# EasyEDA schematic oLoRa-part-SD.json
TITLE: oLoRa-part-SD; REV: 1.0; Date: 2019-08-25; Sheet: 1/1; Drawn By: Kim Seok Hyeon; Company: RMTEC
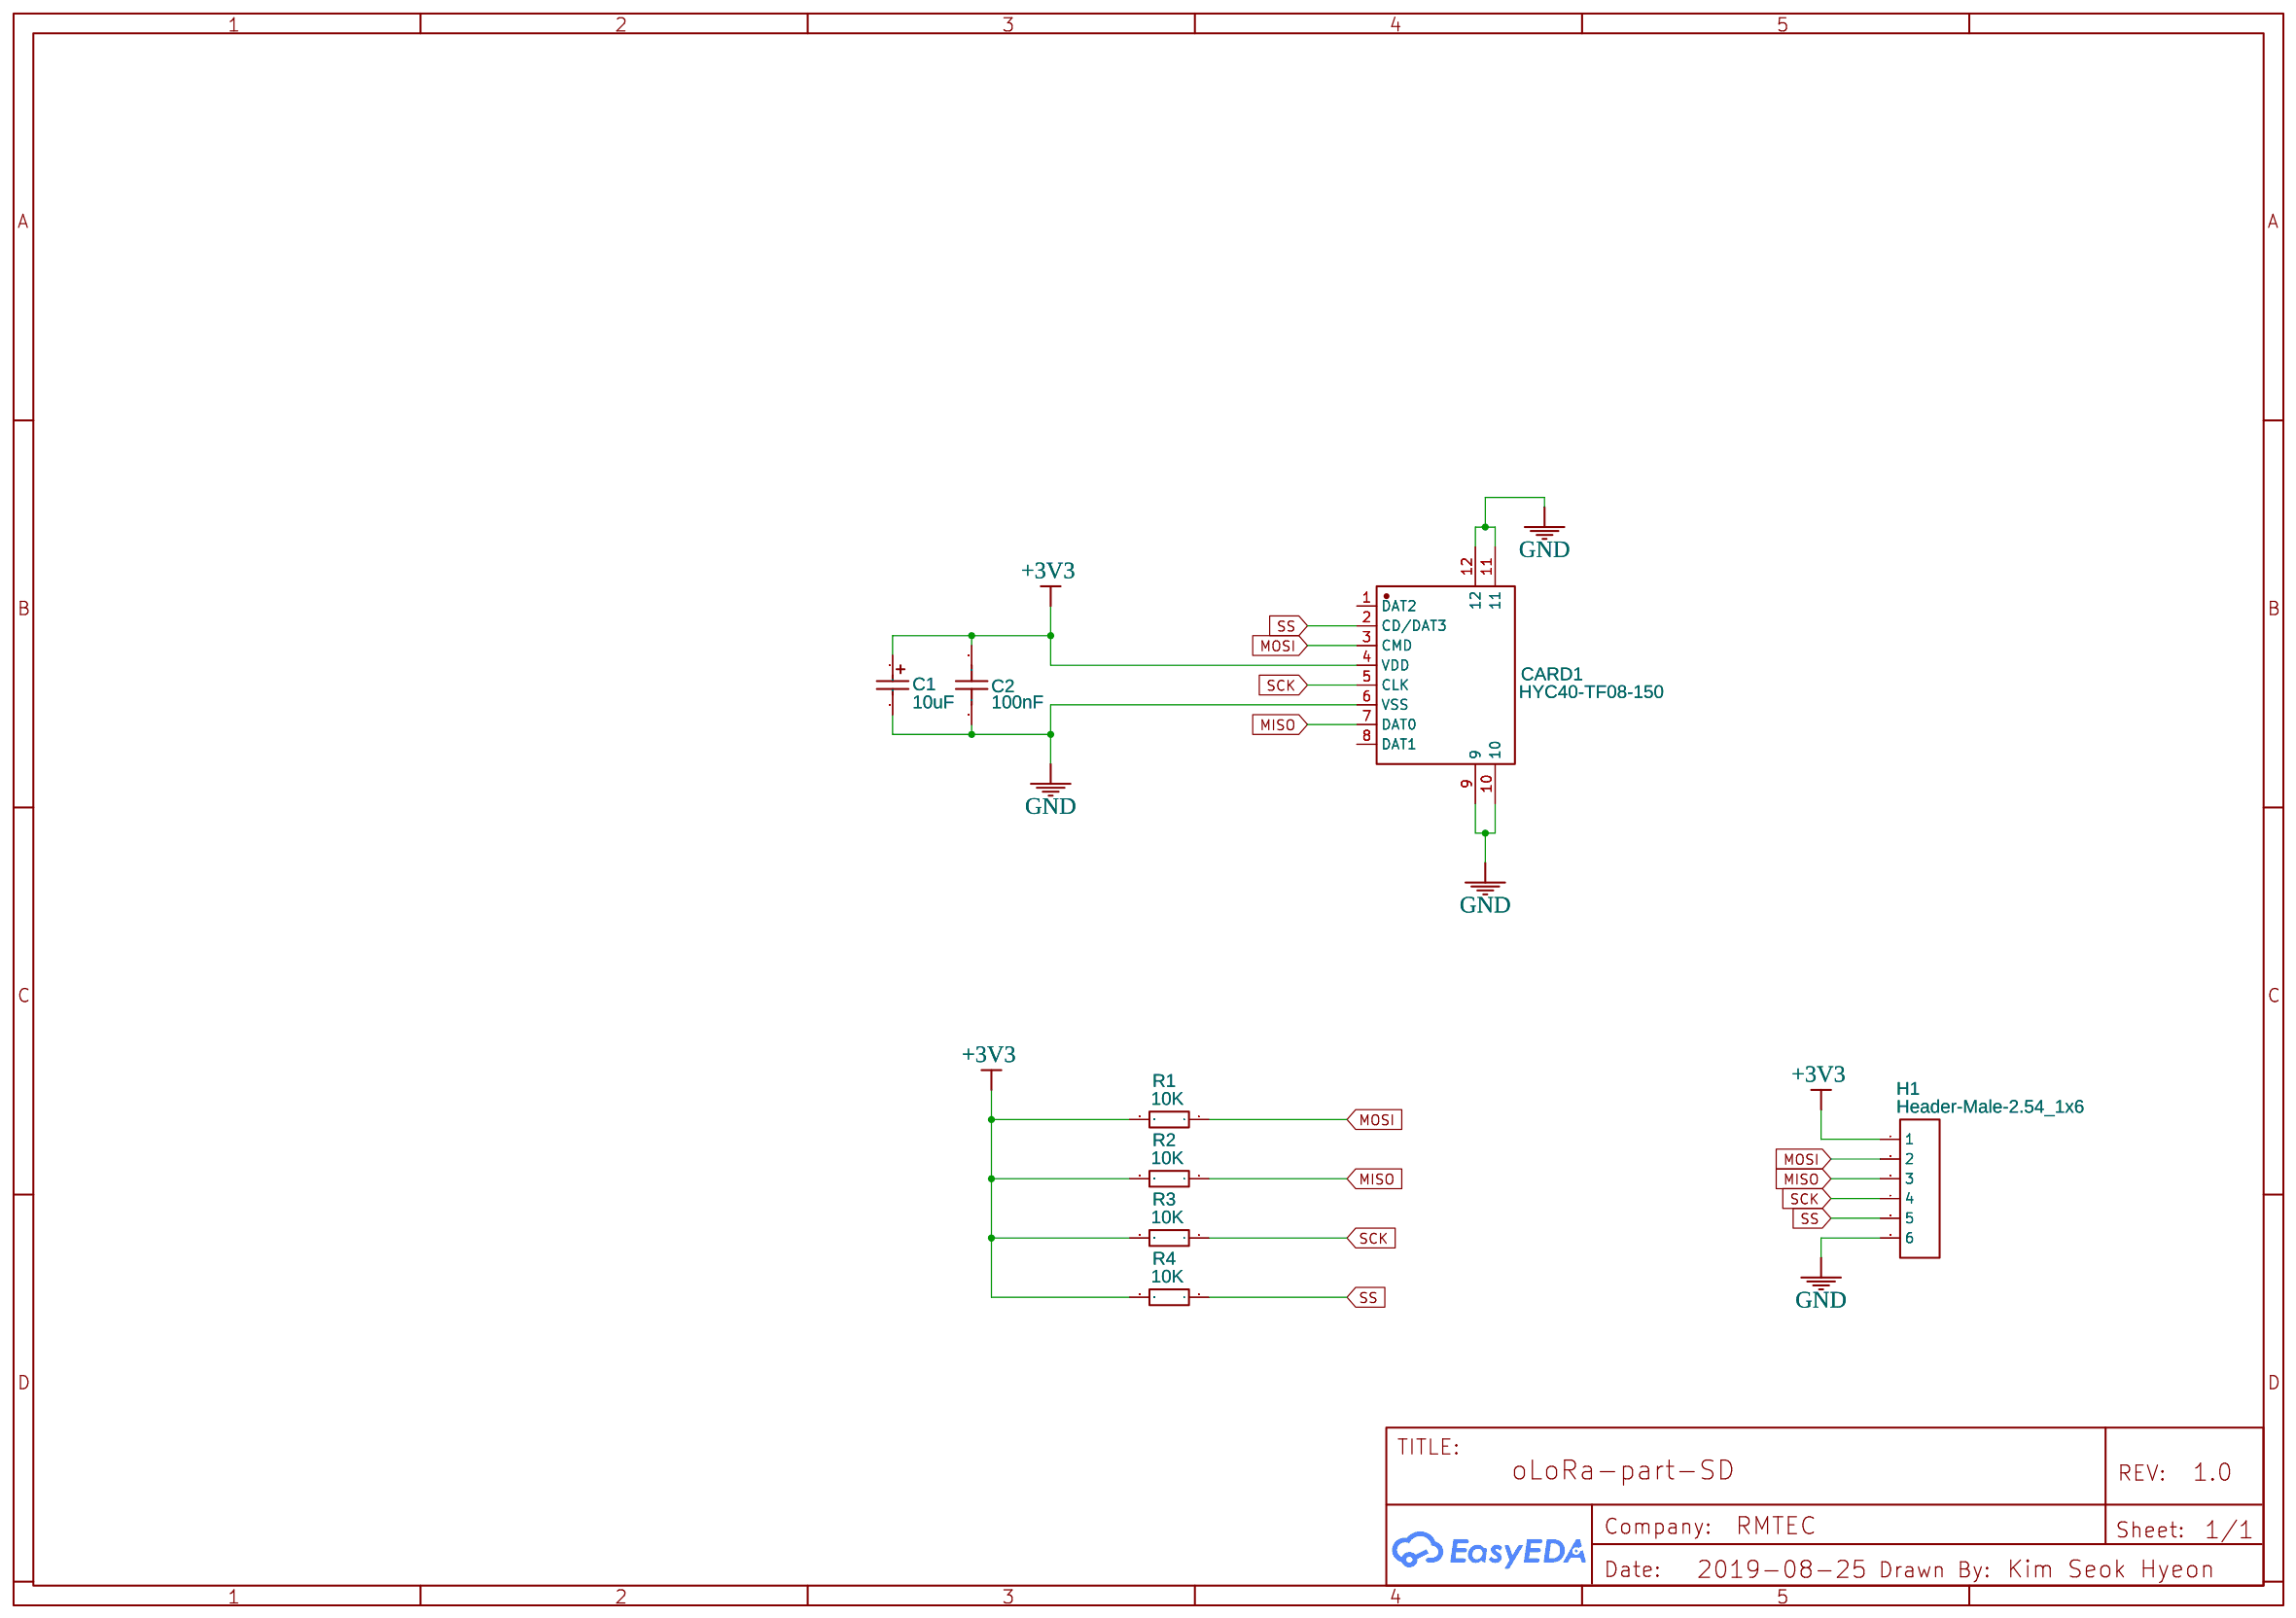
[diagram p0: schematic sheet]

## Parts
C1  10uF  [CAP-CASE-A_3216]
C2  100nF  [0603]
CARD1  HYC40-TF08-150  [TF-002-H18]
H1  Header-Male-2.54_1x6  [HDR-TH_6P-P2.54-V]
R1  10K  [0603]
R2  10K  [0603]
R3  10K  [0603]
R4  10K  [0603]

## Library data of the parts
C1 = TAJA106K016RNJ: Supplier: LCSC; Manufacturer: AVX; LCSC Assembly: Yes; Supplier Part: C7171; SMT Type: Basic
C2 = CC0603KRX7R9BB104: Supplier: LCSC; Manufacturer: YAGEO; LCSC Assembly: Yes; Supplier Part: C14663; SMT Type: Basic
CARD1 = -: Supplier: LCSC; Supplier Part: C341096; Manufacturer: 华宇创; Contributor: LCSC
H1 = -: Supplier: LCSC; Manufacturer: BOOMELE; Supplier Part: C37208
R1-R4 = 0603WAF1002T5E: Supplier: LCSC; Manufacturer: UniOhm; LCSC Assembly: Yes; Supplier Part: C25804; SMT Type: Basic

## Nets
+3V3: C1.1 C2.2 CARD1.4(VDD) H1.1 R1.2 R2.2 R3.2 R4.2
GND: C1.2 C2.1 CARD1.6(VSS) CARD1.9 CARD1.10 CARD1.11 CARD1.12 H1.6
MISO: CARD1.7(DAT0) H1.3 R2.1
MOSI: CARD1.3(CMD) H1.2 R1.1
SCK: CARD1.5(CLK) H1.4 R3.1
SS: CARD1.2(CD/DAT3) H1.5 R4.1

Not connected (* = marked no-connect by the designer): CARD1 1(DAT2) 8(DAT1)
